# EAGLE design stamp-fixed-mk1 (EAGLE 6.4)
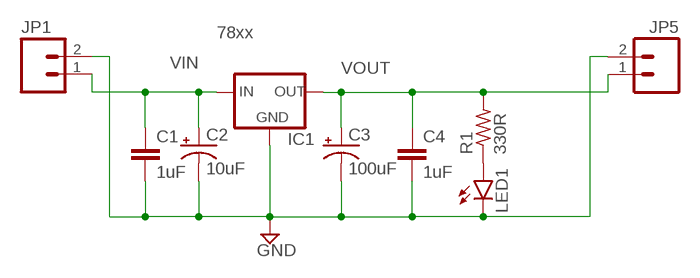
[diagram p0: schematic, sheet 1]

## Parts
C1  1uF  CAPACITOR-CERAMIC025-024X044  [C025-024X044]
C2  10uF  CAPACITOR-POLARIZEDE2.5-6  [E2,5-6]
C3  100uF  CAPACITOR-POLARIZEDE2.5-6  [E2,5-6]
C4  1uF  CAPACITOR-CERAMIC025-024X044  [C025-024X044]
IC1  78xx  V_REG_78XX-TO-220-THERM  [TO-220-SIDE-THERM]
JP1  M02JST-PTH-2  [JST-2-PTH]
JP5  M02JST-PTH-2  [JST-2-PTH]
LED1  LED3MM  [LED3MM]
R1  330R  RESISTORPTH-AXIAL-5.08MM  [AXIAL-PTH-5.08MM]

## Nets
GND: C1.2 C2.- C3.- C4.2 IC1.GND IC1.GND@1(GND) IC1.GND@2(GND) IC1.GND@3(GND) IC1.GND@4(GND) IC1.GND@5(GND) IC1.GND@6(GND) IC1.GND@7(GND) IC1.GND@8(GND) IC1.GND@9(GND) IC1.GND@10(GND) IC1.GND@11(GND) IC1.GND@12(GND) IC1.GND@13(GND) IC1.GND@14(GND) IC1.GND@15(GND) IC1.GND@16(GND) IC1.GND@17(GND) IC1.GND@18(GND) IC1.GND@19(GND) IC1.GND@20(GND) IC1.GND@21(GND) IC1.GND@22(GND) IC1.GND@23(GND) IC1.GND@24(GND) IC1.GND@25(GND) IC1.GND@26(GND) IC1.GND@27(GND) IC1.GND@28(GND) IC1.GND@29(GND) IC1.GND@30(GND) IC1.GND@31(GND) IC1.GND@32(GND) IC1.GND@33(GND) IC1.GND@34(GND) IC1.GND@35(GND) IC1.GND@36(GND) IC1.GND@37(GND) IC1.GND@38(GND) IC1.GND@39(GND) IC1.GND@40(GND) IC1.GND@41(GND) IC1.GND@42(GND) IC1.GND@43(GND) IC1.GND@44(GND) IC1.GND@45(GND) IC1.GND@46(GND) IC1.GND@47(GND) IC1.GND@48(GND) IC1.GND@49(GND) IC1.GND@50(GND) IC1.GND@51(GND) IC1.GND@52(GND) IC1.GND@53(GND) IC1.GND@54(GND) JP1.2 JP5.2 LED1.K(C)
N$3: LED1.A R1.P$1
VIN: C1.1 C2.+ IC1.IN JP1.1
VOUT: C3.+ C4.1 IC1.OUT JP5.1 R1.P$2

## Library data of the parts
C1 C4 = A_butts:CAPACITOR-CERAMIC: CAPACITOR, European symbol
C2 C3 = A_butts:CAPACITOR-POLARIZED: POLARIZED CAPACITOR, American symbol
IC1 = A_butts:V_REG_78XX: Voltage Regulator Standard 7805 5V regulator. IGO (Input Ground Output). Spark Fun Electronics SKU : COM-00107
JP1 JP5 = A_butts:M02: Standard 2-pin 0.1" header. Use with - straight break away headers ( PRT-00116) - right angle break away headers (PRT-00553) - swiss pins (PRT-00743) - machine pins (PRT-00117) - female headers (PRT-00115) Molex polarized connector foot print use with: PRT-08233 with associated crimp pins and housings. 2.54_SCREWTERM for use with PRT-10571. 3.5mm Screw Terminal footprints for PRT-08084 5mm Screw Terminal footprints for use with PRT-08433; SKU: PRT-09914
LED1 = A_butts:LED: LEDs Standard schematic elements and footprints for 5mm, 3mm, 1206, and 0603 sized LEDs. 5mm - Spark Fun Electronics SKU : COM-00529 (and others)
R1 = A_butts:RESISTOR: RESISTOR, American symbol

## Board
Postage Stamp Power Supply Small linear power supply with flexible layout.
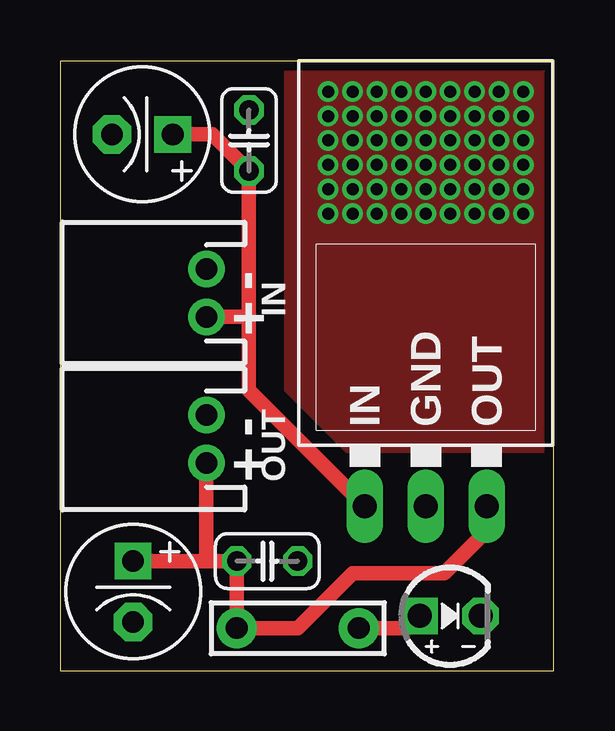
[diagram p1: board, top side]
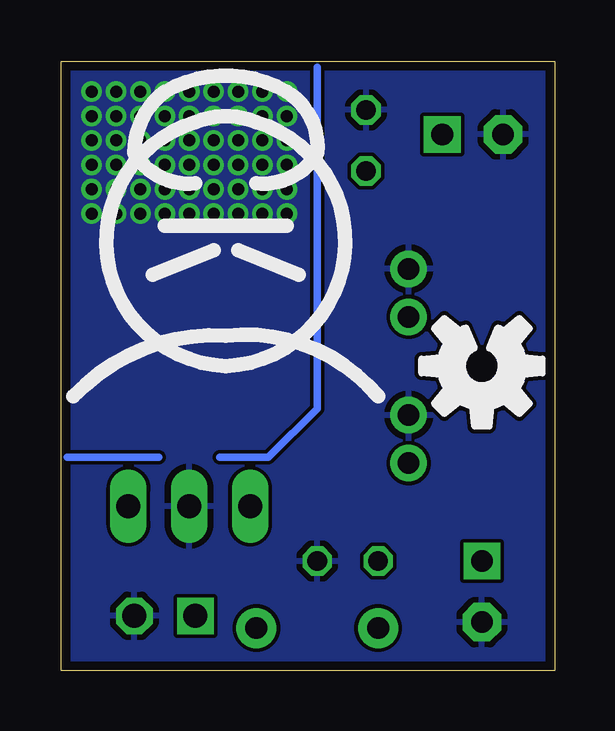
[diagram p2: board, bottom side, seen from below]

Size 20.57 x 25.4 mm. Coordinates in mm from the lower left corner, seen from the top.
Outline: 0,0 20.57,0 20.57,25.4 0,25.4 0,0
Copper layers (1*16): Top 0.0356mm / dielectric 1.5011mm / Bottom 0.0356mm
Design rules "LaenPCBOrder *": minimum track width 6mil, minimum drill 13mil, track to track 6mil, track to pad 6mil, pad to pad 6mil, via to via 6mil, smd to smd 6mil, copper to edge 15mil, drill to drill 6mil, minimum pad ring 7mil, minimum via ring 7mil, stop-mask expansion 3mil, vias tented up to drill 20mil, thermal gap 10mil

### Footprints (pad centres in the part's own frame; a part is rotated, then mirrored left to right if it is on the bottom)
C025-024X044 = drill 0.813 octagon: 1 -1.27,0; 2 1.27,0
E2,5-6 = drill 0.9 pad 1.524 square: + -1.27,0 | drill 0.9 pad 1.6 octagon: - 1.27,0
TO-220-SIDE-THERM = drill 1.016 long: GND 0,0; IN -2.54,0; OUT 2.54,0 | drill 0.5: GND@1 -4.064,17.272; GND@2 -3.048,17.272; GND@3 -2.032,17.272; GND@4 -1.016,17.272; GND@5 0,17.272; GND@6 1.016,17.272; GND@7 2.032,17.272; GND@8 3.048,17.272; GND@9 4.064,17.272; GND@10 -4.064,16.256; GND@11 -3.048,16.256; GND@12 -2.032,16.256; GND@13 -1.016,16.256; GND@14 0,16.256; GND@15 1.016,16.256; GND@16 2.032,16.256; GND@17 3.048,16.256; GND@18 4.064,16.256; GND@19 -4.064,15.24; GND@20 -3.048,15.24; GND@21 -2.032,15.24; GND@22 -1.016,15.24; GND@23 0,15.24; GND@24 1.016,15.24; GND@25 2.032,15.24; GND@26 3.048,15.24; GND@27 4.064,15.24; GND@28 -4.064,14.224; GND@29 -3.048,14.224; GND@30 -2.032,14.224; GND@31 -1.016,14.224; GND@32 0,14.224; GND@33 1.016,14.224; GND@34 2.032,14.224; GND@35 3.048,14.224; GND@36 4.064,14.224; GND@37 -4.064,13.208; GND@38 -3.048,13.208; GND@39 -2.032,13.208; GND@40 -1.016,13.208; GND@41 0,13.208; GND@42 1.016,13.208; GND@43 2.032,13.208; GND@44 3.048,13.208; GND@45 4.064,13.208; GND@46 -4.064,12.192; GND@47 -3.048,12.192; GND@48 -2.032,12.192; GND@49 -1.016,12.192; GND@50 0,12.192; GND@51 1.016,12.192; GND@52 2.032,12.192; GND@53 3.048,12.192; GND@54 4.064,12.192
JST-2-PTH = drill 0.9 pad 1.524: 1 -1,0; 2 1,0
LED3MM = drill 1 pad 1.524 square: A -1.27,0 | drill 1 pad 1.524 octagon: K 1.27,0
AXIAL-PTH-5.08MM = drill 0.9 pad 1.676: P$1 -2.54,0; P$2 2.54,0

### Placement (x,y rotation side)
C1  7.87,22.1 90 top
C2  3.43,22.35 180 top
C3  3.05,3.3 270 top
C4  8.64,4.57 0 top
IC1  15.24,6.86 0 top
JP1  6.1,15.75 90 top
JP5  6.1,9.65 90 top
LED1  16.26,2.29 0 top
R1  9.91,1.78 180 top
U$1  [OSHWLOGO_BOT_0.2_A]  3.05,12.7 180 top
U$2  [COW]  13.72,19.05 180 bottom

### Tracks (layer width: path | path; a pad name or v marks a point on that pad's centre or on a via)
GND
  pour Bottom: 0,25.4 20.57,25.4 20.57,0 0,0
  pour Top (no thermals): 9.4,25.4 9.4,11.94 9.4,11.68 11.94,9.14 20.57,9.14 20.57,25.4
  pour Bottom (no thermals): 9.4,25.4 9.4,19.3 10.92,17.78 19.56,17.78 20.57,18.8 20.57,25.4
N$1
  Bottom 0.305: 9.91,25.15 9.91,10.92 11.94,8.89 13.97,8.89
N$3
  Top 0.61: R1.P$1 14.48,1.78 LED1.A
N$4
  Bottom 0.305: 16.51,8.89 20.32,8.89
VIN
  Top 0.61: C2.+ 6.35,22.35 C1.1 7.87,14.73 | 7.87,14.73 7.87,11.68 IC1.IN | JP1.1 7.86,14.75 7.87,14.73
VOUT
  Top 0.61: C3.+ 6.1,4.57 | 6.1,4.57 C4.1 R1.P$2 9.91,1.78 12.19,4.06 16,4.06 17.78,5.84 IC1.OUT | JP5.1 6.1,4.57

### Text on the board
tPlace: - | + | IN | - | + | OUT